# Altium schematic sheet TOP.SchDoc: =ProjectName
size 420 x 297 mm; Author: Paweł Kulik; CompanyName: WUT; DrawnBy: Paweł Kulik; Organization: WUT ISE; Address1: Warsaw Univeristy of Technology; Address2: Nowowiejska 15/19; DocumentNumber: 1; Revision: 2.0.2; SheetNumber: 1; SheetTotal: 11; EDA_Number: ARTIQ; Projet: ARTIQ/SINARA; ModifiedBy: -; CheckedDate: -; Title2: TOP.SchDoc; DivGrp: ISE; Designer: Paweł Kulik; ModifiedDate: -; ProjectName: ARTIQ/SINARA
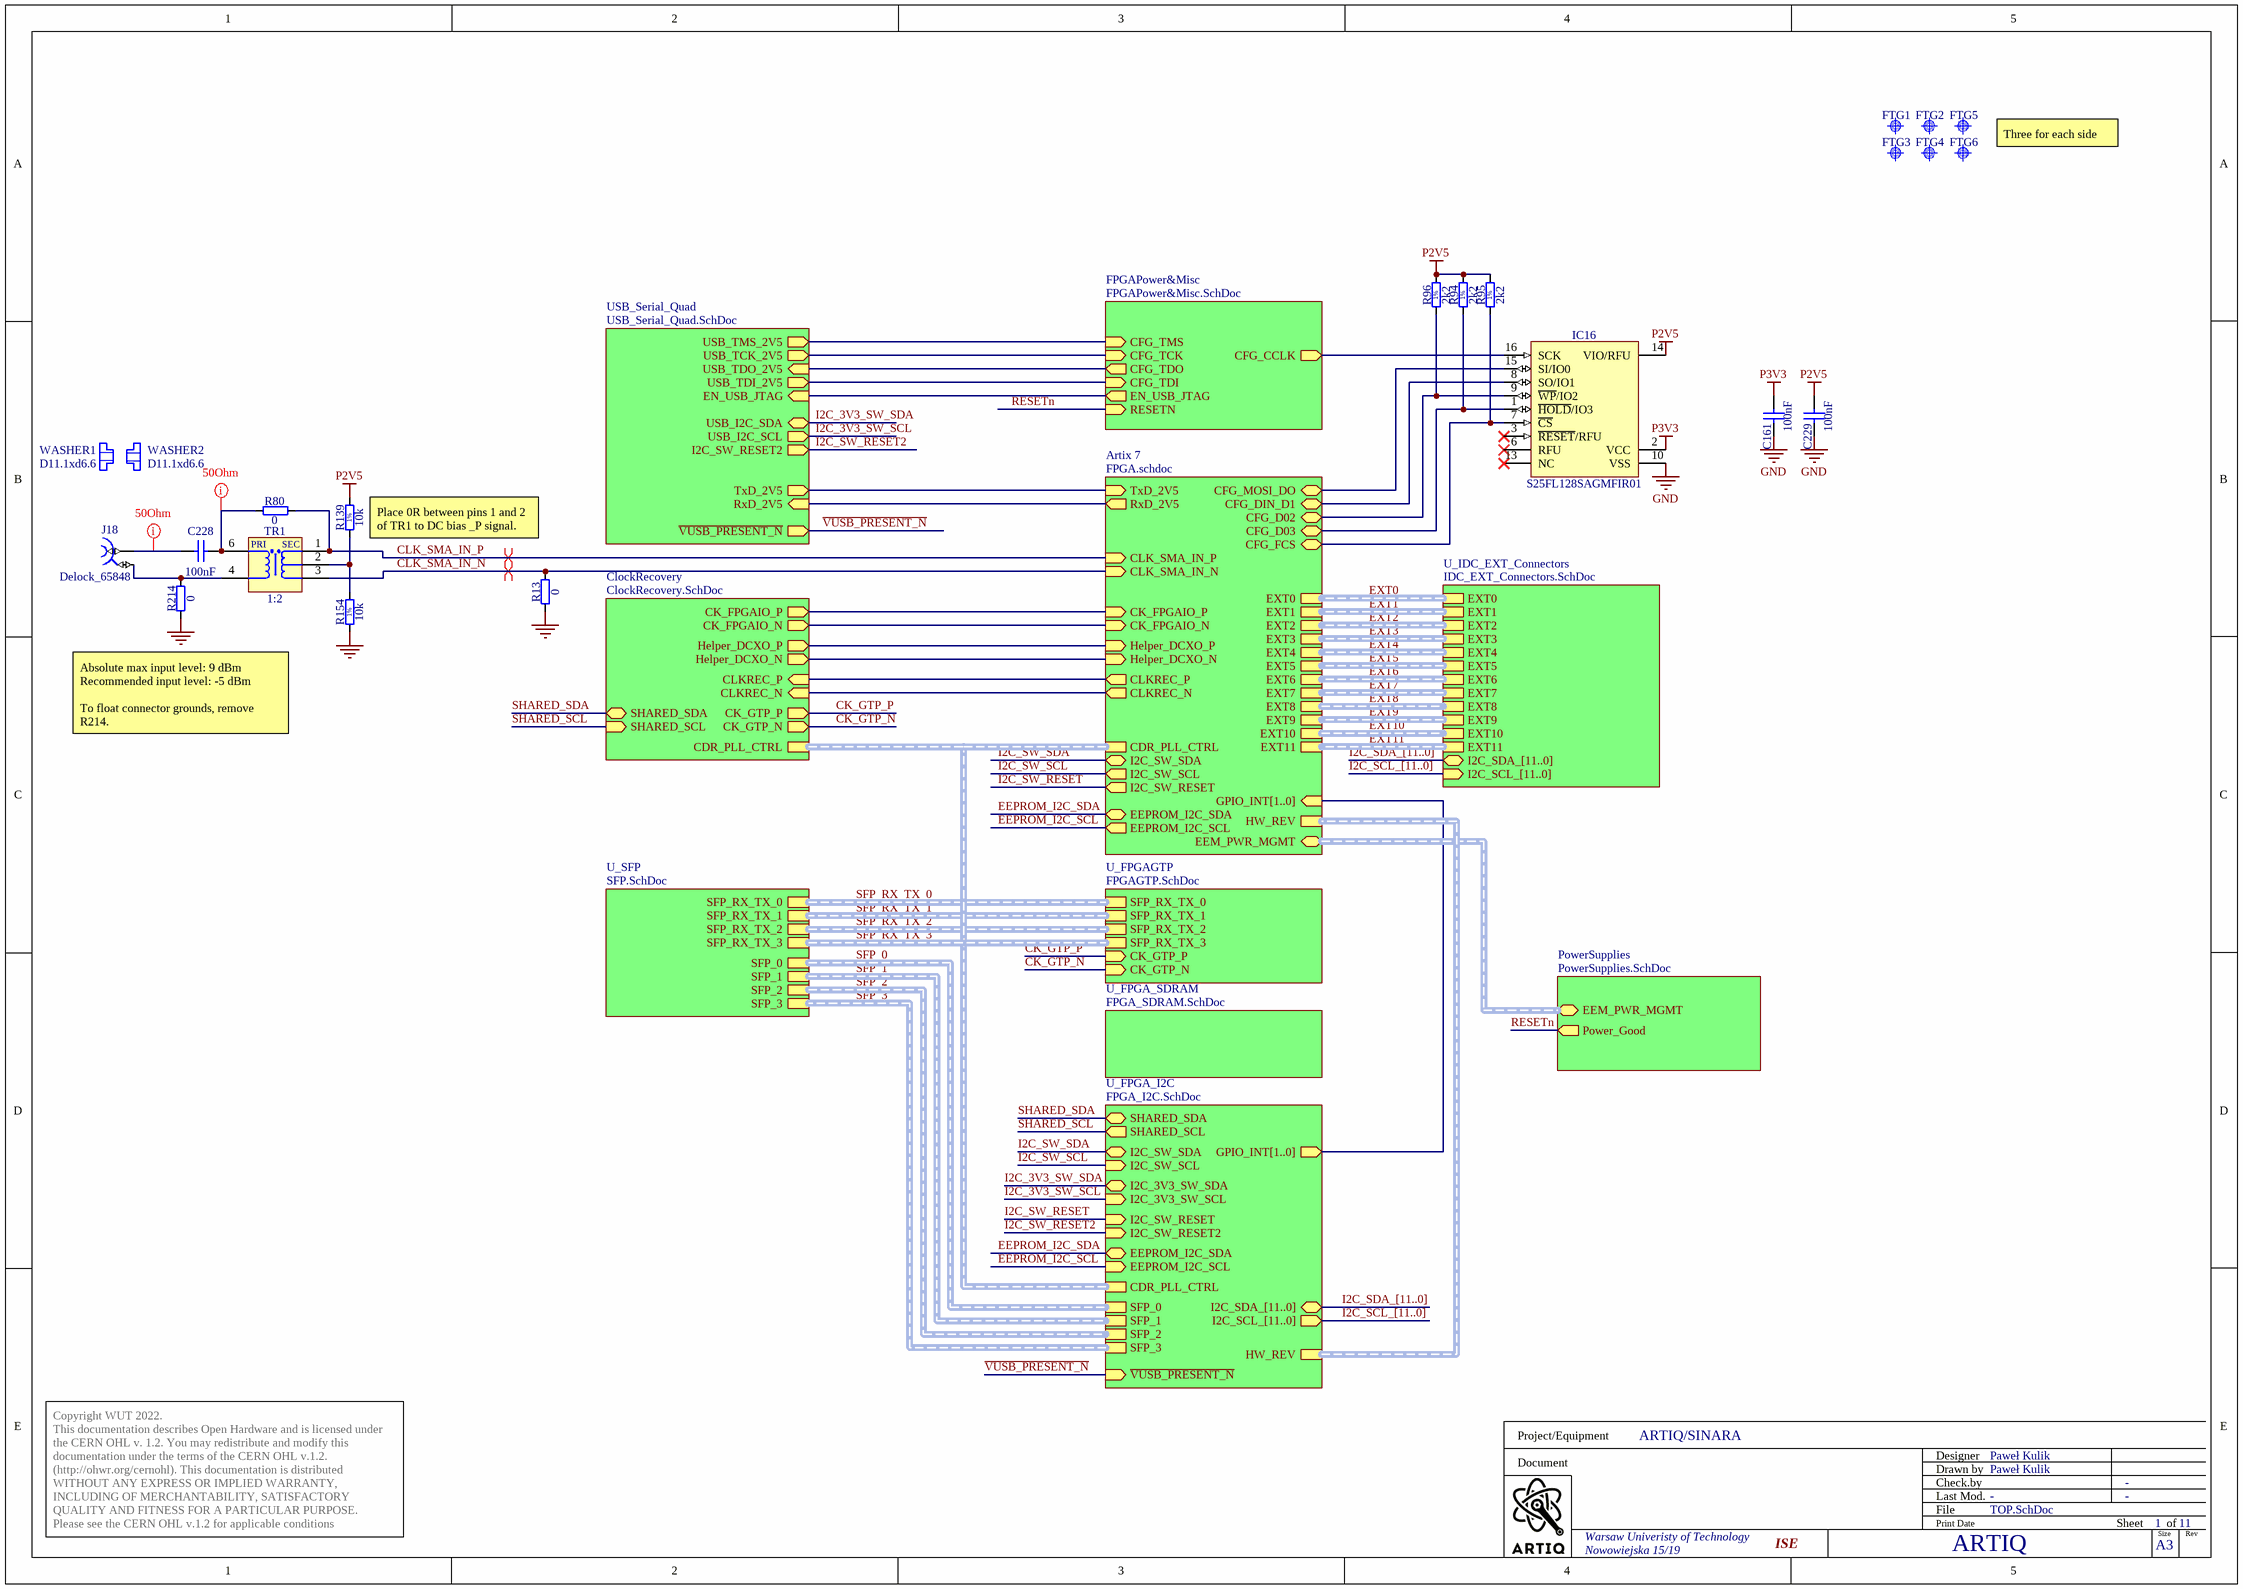
[diagram p0: TOP.SchDoc]

## Parts
C161  100nF  [CAPC0603X33N]
C228  100nF  [CAPC0603X33N]
C229  100nF  [CAPC0603X33N]
FTG1  Use only in PCB  [FIDUCIAL_TOP_C100-200]  (value not drawn)  (no BOM)
FTG2  Use only in PCB  [FIDUCIAL_TOP_S100-200]  (value not drawn)  (no BOM)
FTG3  Use only in PCB  [FIDUCIAL_TOP_C100-200]  (value not drawn)  (no BOM)
FTG4  Use only in PCB  [FIDUCIAL_TOP_C100-200]  (value not drawn)  (no BOM)
FTG5  Use only in PCB  [FIDUCIAL_TOP_C100-200]  (value not drawn)  (no BOM)
FTG6  Use only in PCB  [FIDUCIAL_TOP_S100-200]  (value not drawn)  (no BOM)
IC16  S25FL128SAGMFIR01  [SOIC127P1030X265-16N]
J18  Delock_65848  [Delock_65848]
R13  0  [RESC1005X40N]
R80  0  [RESC1005X40N]
R94  2k2  [RESC1005X40N]
R95  2k2  [RESC1005X40N]
R96  2k2  [RESC1005X40N]
R139  10k  [RESC1005X40N]
R154  10k  [RESC1005X40N]
R214  0  [RESC1005X40N]
TR1  1:2  [XFMR_MINI-CIRCUITS_AT1521]
WASHER1  D11.1xd6.6  [Keystone_7687]
WASHER2  D11.1xd6.6  [Keystone_7687]

## Sub-sheets
Artix 7 = FPGA.schdoc: CLKREC_P (out), CLKREC_N (out), CK_FPGAIO_P (in), CK_FPGAIO_N (in), I2C_SW_SDA (bidir), I2C_SW_SCL (out), CFG_MOSI_DO (bidir), CFG_DIN_D1 (bidir), CFG_D02 (bidir), CFG_D03 (bidir), CFG_FCS (bidir), TxD_2V5 (in), RxD_2V5 (out), GPIO_INT[1..0] (in), CDR_PLL_CTRL (harness CDR_PLL_CTRL), CLK_SMA_IN_P (in), Helper_DCXO_N (in), Helper_DCXO_P (in), I2C_SW_RESET (out), CLK_SMA_IN_N (in), EXT9 (harness ExtensionConnector), EXT7 (harness ExtensionConnector), EXT6 (harness ExtensionConnector), EXT11 (harness ExtensionConnector), EXT8 (harness ExtensionConnector), EXT10 (harness ExtensionConnector), EXT5 (harness ExtensionConnector), EXT4 (harness ExtensionConnector), EXT3 (harness ExtensionConnector), EXT2 (harness ExtensionConnector), EXT1 (harness ExtensionConnector), EXT0 (harness ExtensionConnector), EEPROM_I2C_SCL (out), EEPROM_I2C_SDA (bidir), EEM_PWR_MGMT (bidir), HW_REV
ClockRecovery = ClockRecovery.SchDoc: CLKREC_P (in), CLKREC_N (in), SHARED_SDA (bidir), SHARED_SCL (in), CK_GTP_P (out), CK_GTP_N (out), CK_FPGAIO_P (out), CK_FPGAIO_N (out), CDR_PLL_CTRL (harness CDR_PLL_CTRL), Helper_DCXO_N (out), Helper_DCXO_P (out)
FPGAPower&Misc = FPGAPower&Misc.SchDoc: RESETN (in), CFG_CCLK (out), CFG_TMS (in), CFG_TCK (in), CFG_TDO (out), CFG_TDI (in), EN_USB_JTAG (out)
PowerSupplies = PowerSupplies.SchDoc: Power_Good (out), EEM_PWR_MGMT (bidir)
U_FPGA_I2C = FPGA_I2C.SchDoc: I2C_SDA_[11..0] (bidir), I2C_SW_SDA (bidir), I2C_SCL_[11..0] (out), SHARED_SDA (bidir), SHARED_SCL (out), I2C_SW_SCL (in), I2C_3V3_SW_SCL (in), I2C_3V3_SW_SDA (bidir), I2C_SW_RESET (in), SFP_0 (harness SFP), SFP_2 (harness SFP), SFP_1 (harness SFP), ~{VUSB_PRESENT_N} (in), GPIO_INT[1..0] (out), CDR_PLL_CTRL (harness CDR_PLL_CTRL), SFP_3 (harness SFP), I2C_SW_RESET2 (in), EEPROM_I2C_SDA (bidir), EEPROM_I2C_SCL (in), HW_REV (harness HW_REV)
U_FPGA_SDRAM = FPGA_SDRAM.SchDoc: no entries
U_FPGAGTP = FPGAGTP.SchDoc: SFP_RX_TX_0 (harness SFP_RX_TX), SFP_RX_TX_1 (harness SFP_RX_TX), SFP_RX_TX_2 (harness SFP_RX_TX), CK_GTP_P (in), CK_GTP_N (in), SFP_RX_TX_3 (harness SFP_RX_TX)
U_IDC_EXT_Connectors = IDC_EXT_Connectors.SchDoc: I2C_SDA_[11..0] (bidir), I2C_SCL_[11..0] (in), EXT7 (harness ExtensionConnector), EXT9 (harness ExtensionConnector), EXT11 (harness ExtensionConnector), EXT6 (harness ExtensionConnector), EXT2 (harness ExtensionConnector), EXT10 (harness ExtensionConnector), EXT8 (harness ExtensionConnector), EXT5 (harness ExtensionConnector), EXT3 (harness ExtensionConnector), EXT4 (harness ExtensionConnector), EXT0 (harness ExtensionConnector), EXT1 (harness ExtensionConnector)
U_SFP = SFP.SchDoc: SFP_0 (harness SFP), SFP_RX_TX_0 (harness SFP_RX_TX), SFP_2 (harness SFP), SFP_RX_TX_1 (harness SFP_RX_TX), SFP_RX_TX_2 (harness SFP_RX_TX), SFP_1 (harness SFP), SFP_3 (harness SFP), SFP_RX_TX_3 (harness SFP_RX_TX)
USB_Serial_Quad = USB_Serial_Quad.SchDoc: USB_TDO_2V5 (in), RxD_2V5 (in), USB_TMS_2V5 (out), USB_TDI_2V5 (out), USB_TCK_2V5 (out), TxD_2V5 (out), EN_USB_JTAG (in), USB_I2C_SCL (out), USB_I2C_SDA (bidir), ~{VUSB_PRESENT_N} (out), I2C_SW_RESET2 (out)

## Nets
GND: C161.1 C229.1 IC16.10(VSS) R13.1 R154.2 R214.1
P2V5: C229.2 IC16.14(VIO/RFU) R94.2 R95.2 R96.2 R139.1
P3V3: C161.2 IC16.2(VCC)
~{VUSB_PRESENT_N}: sheet U_FPGA_I2C/~{VUSB_PRESENT_N}, sheet USB_Serial_Quad/~{VUSB_PRESENT_N}
CK_GTP_N: sheet ClockRecovery/CK_GTP_N, sheet U_FPGAGTP/CK_GTP_N
CK_GTP_P: sheet ClockRecovery/CK_GTP_P, sheet U_FPGAGTP/CK_GTP_P
CLK_SMA_IN_N: R13.2 TR1.3(S) ; sheet Artix 7/CLK_SMA_IN_N
CLK_SMA_IN_P: R80.2 TR1.1(SDOT) ; sheet Artix 7/CLK_SMA_IN_P
EEPROM_I2C_SCL: sheet Artix 7/EEPROM_I2C_SCL, sheet U_FPGA_I2C/EEPROM_I2C_SCL
EEPROM_I2C_SDA: sheet Artix 7/EEPROM_I2C_SDA, sheet U_FPGA_I2C/EEPROM_I2C_SDA
I2C_3V3_SW_SCL: sheet U_FPGA_I2C/I2C_3V3_SW_SCL, sheet USB_Serial_Quad/USB_I2C_SCL
I2C_3V3_SW_SDA: sheet U_FPGA_I2C/I2C_3V3_SW_SDA, sheet USB_Serial_Quad/USB_I2C_SDA
I2C_SW_RESET: sheet Artix 7/I2C_SW_RESET, sheet U_FPGA_I2C/I2C_SW_RESET
I2C_SW_RESET2: sheet U_FPGA_I2C/I2C_SW_RESET2, sheet USB_Serial_Quad/I2C_SW_RESET2
I2C_SW_SCL: sheet Artix 7/I2C_SW_SCL, sheet U_FPGA_I2C/I2C_SW_SCL
I2C_SW_SDA: sheet Artix 7/I2C_SW_SDA, sheet U_FPGA_I2C/I2C_SW_SDA
RESETn: sheet PowerSupplies/Power_Good, sheet FPGAPower&Misc/RESETN
SHARED_SCL: sheet ClockRecovery/SHARED_SCL, sheet U_FPGA_I2C/SHARED_SCL
SHARED_SDA: sheet ClockRecovery/SHARED_SDA, sheet U_FPGA_I2C/SHARED_SDA
NetC228_1: C228.1 J18.1
NetC228_2: C228.2 R80.1 TR1.6(PDOT)
NetIC16_1: IC16.1(~{HOLD}/IO3) R94.1 ; sheet Artix 7/CFG_D03
NetIC16_7: IC16.7(~{CS}) R95.1 ; sheet Artix 7/CFG_FCS
NetIC16_8: IC16.8(SO/IO1) ; sheet Artix 7/CFG_DIN_D1
NetIC16_9: IC16.9(~{WP}/IO2) R96.1 ; sheet Artix 7/CFG_D02
NetIC16_15: IC16.15(SI/IO0) ; sheet Artix 7/CFG_MOSI_DO
NetIC16_16: IC16.16(SCK) ; sheet FPGAPower&Misc/CFG_CCLK
NetJ18_2: J18.2 R214.2 TR1.4(P)
NetR139_2: R139.2 R154.1 TR1.2(NC)
(unnamed): sheet Artix 7/CLKREC_P, sheet ClockRecovery/CLKREC_P
(unnamed): sheet Artix 7/CLKREC_N, sheet ClockRecovery/CLKREC_N
(unnamed): sheet Artix 7/CK_FPGAIO_P, sheet ClockRecovery/CK_FPGAIO_P
(unnamed): sheet Artix 7/CK_FPGAIO_N, sheet ClockRecovery/CK_FPGAIO_N
(unnamed): sheet Artix 7/TxD_2V5, sheet USB_Serial_Quad/TxD_2V5
(unnamed): sheet Artix 7/RxD_2V5, sheet USB_Serial_Quad/RxD_2V5
(unnamed): sheet Artix 7/Helper_DCXO_N, sheet ClockRecovery/Helper_DCXO_N
(unnamed): sheet Artix 7/Helper_DCXO_P, sheet ClockRecovery/Helper_DCXO_P
(unnamed): sheet FPGAPower&Misc/CFG_TMS, sheet USB_Serial_Quad/USB_TMS_2V5
(unnamed): sheet FPGAPower&Misc/CFG_TCK, sheet USB_Serial_Quad/USB_TCK_2V5
(unnamed): sheet FPGAPower&Misc/CFG_TDO, sheet USB_Serial_Quad/USB_TDO_2V5
(unnamed): sheet FPGAPower&Misc/CFG_TDI, sheet USB_Serial_Quad/USB_TDI_2V5
(unnamed): sheet FPGAPower&Misc/EN_USB_JTAG, sheet USB_Serial_Quad/EN_USB_JTAG

Not connected (* = marked no-connect by the designer): IC16 3(~{RESET}/RFU)* 6(RFU)* 13(NC)*

## Buses and harness runs
bus I2C_SCL_[11..0] = sheet U_FPGA_I2C/I2C_SCL_[11..0]
bus I2C_SCL_[11..0] = sheet U_IDC_EXT_Connectors/I2C_SCL_[11..0]
bus I2C_SDA_[11..0] = sheet U_FPGA_I2C/I2C_SDA_[11..0]
bus I2C_SDA_[11..0] = sheet U_IDC_EXT_Connectors/I2C_SDA_[11..0]
bus sheet Artix 7/GPIO_INT[1..0] = sheet U_FPGA_I2C/GPIO_INT[1..0]
harness EXT0 = sheet Artix 7/EXT0 = sheet U_IDC_EXT_Connectors/EXT0
harness EXT1 = sheet Artix 7/EXT1 = sheet U_IDC_EXT_Connectors/EXT1
harness EXT2 = sheet Artix 7/EXT2 = sheet U_IDC_EXT_Connectors/EXT2
harness EXT3 = sheet Artix 7/EXT3 = sheet U_IDC_EXT_Connectors/EXT3
harness EXT4 = sheet Artix 7/EXT4 = sheet U_IDC_EXT_Connectors/EXT4
harness EXT5 = sheet Artix 7/EXT5 = sheet U_IDC_EXT_Connectors/EXT5
harness EXT6 = sheet Artix 7/EXT6 = sheet U_IDC_EXT_Connectors/EXT6
harness EXT7 = sheet Artix 7/EXT7 = sheet U_IDC_EXT_Connectors/EXT7
harness EXT8 = sheet Artix 7/EXT8 = sheet U_IDC_EXT_Connectors/EXT8
harness EXT9 = sheet Artix 7/EXT9 = sheet U_IDC_EXT_Connectors/EXT9
harness EXT10 = sheet Artix 7/EXT10 = sheet U_IDC_EXT_Connectors/EXT10
harness EXT11 = sheet Artix 7/EXT11 = sheet U_IDC_EXT_Connectors/EXT11
harness SFP_0 = sheet U_FPGA_I2C/SFP_0 = sheet U_SFP/SFP_0
harness SFP_1 = sheet U_FPGA_I2C/SFP_1 = sheet U_SFP/SFP_1
harness SFP_2 = sheet U_FPGA_I2C/SFP_2 = sheet U_SFP/SFP_2
harness SFP_3 = sheet U_FPGA_I2C/SFP_3 = sheet U_SFP/SFP_3
harness SFP_RX_TX_0 = sheet U_FPGAGTP/SFP_RX_TX_0 = sheet U_SFP/SFP_RX_TX_0
harness SFP_RX_TX_1 = sheet U_FPGAGTP/SFP_RX_TX_1 = sheet U_SFP/SFP_RX_TX_1
harness SFP_RX_TX_2 = sheet U_FPGAGTP/SFP_RX_TX_2 = sheet U_SFP/SFP_RX_TX_2
harness SFP_RX_TX_3 = sheet U_FPGAGTP/SFP_RX_TX_3 = sheet U_SFP/SFP_RX_TX_3
harness sheet Artix 7/CDR_PLL_CTRL = sheet ClockRecovery/CDR_PLL_CTRL = sheet U_FPGA_I2C/CDR_PLL_CTRL
harness sheet Artix 7/EEM_PWR_MGMT = sheet PowerSupplies/EEM_PWR_MGMT
harness sheet Artix 7/HW_REV = sheet U_FPGA_I2C/HW_REV

## Layout directives
net class 50Ohm: NetC228_1, NetC228_2
differential pair; differential pair class Diff_100Ohm: CLK_SMA_IN_N, CLK_SMA_IN_P

## Notes on the sheet
- Three for each side
- (near R139) Place 0R between pins 1 and 2 of TR1 to DC bias _P signal.
- (near R214) Absolute max input level: 9 dBm
  Recommended input level: -5 dBm
  To float connector grounds, remove R214.
- Project/Equipment
- Document
- Designer
- Drawn by
- Check.by
- Copyright WUT 2022.
  This documentation describes Open Hardware and is licensed under the CERN OHL v. 1.2. You may redistribute and modify this documentation under the terms of the CERN OHL v.1.2. (http://ohwr.org/cernohl). This documentation is distributed WITHOUT ANY EXPRESS OR IMPLIED WARRANTY, INCLUDING OF MERCHANTABILITY, SATISFACTORY QUALITY AND FITNESS FOR A PARTICULAR PURPOSE. Please see the CERN OHL v.1.2 for applicable conditions
- File
- Last Mod.
- Print Date
- Sheet
- Size
- A3
- of
- Rev
- (in symbol R0402_2K2_1%_0.0625W_100PPM) 1%
- (in symbol R0402_10K_1%_0.0625W_100PPM) 1%
- (in symbol XFMR_MINI-CIRCUITS_TC2-1TX+) PRI; SEC

## Library data of the parts
C161 C228 C229 = CC0201_100NF_6.3V_10%_X5R: Non-polarised capacitor; Part Description: SMD Multilayer Chip Ceramic Capacitor; Manufacturer: GENERIC; Manufacturer1 Part Number: 02016D104KAT2A; Voltage: 6.3V; TC: X5R; Tolerance: ±10%; Part Number: CC0201_100NF_6.3V_10%_X5R; Component Kind: Standard; Component Type: Standard; Pin Count: 2; Value: 100nF; Status: Not Recommended; Manufacturer Part Number: CC0201_100NF_6.3V_10%_X5R; Case: 0201; Mounted: Yes; Socket: No; SMD: Yes; Sense: No; Manufacturer1 Example: AVX; Manufacturer1 ComponentHeight: 0.33mm; HelpURL: \\cern.ch\dfs\Applications\Altium\Datasheets\CC0201_X5R_AVX.pdf; Author: CERN DEM JLC
  C161 C229: CreateDate: 03.12.2007; LatestRevisionDate: 03.12.2007; ClassName: Artix
  C228: CreateDate: 2007-12-03; LatestRevisionDate: 2007-12-03
FTG1 FTG3-FTG5 = FIDUCIAL_TARGET_C100-200: Fiducial Target; Part Description: Round Fiducial Target, Top Layer, 1.0mm, Top Solder 2.0mm, Keepout =2.0mm; Mounted: No; Part Number: FIDUCIAL_TARGET_C100-200; Component Type: Standard (No BOM); Pin Count: 1; Family: Fiducial; Socket: No; SMD: Yes; Sense: No; Status: None; ComponentHeight: 0mm; HelpURL: Undefined; Author: CERN DEM JLC; CreateDate: 09.02.2010; LatestRevisionDate: 04.04.2012; PackageDescription: Round Fiducial Target, Top Layer, 1.0mm, Top Solder 2.0mm, Keepout =2.0mm
FTG2 FTG6 = FIDUCIAL_TARGET_S100-200: Fiducial Target; Part Description: Square Fiducial Target, Top Layer, 1.0mm, Top Solder 2.0mm, Keepout =2.0mm; Mounted: No; Part Number: FIDUCIAL_TARGET_S100-200; Component Type: Standard (No BOM); Pin Count: 1; Family: Fiducial; Socket: No; SMD: Yes; Sense: No; Status: None; ComponentHeight: 0mm; HelpURL: Undefined; Author: CERN DEM JLC; CreateDate: 09.02.2010; LatestRevisionDate: 04.04.2012; PackageDescription: Square Fiducial Target, Top Layer, 1.0mm, Top Solder 2.0mm, Keepout =2.0mm
IC16 = S25FL128SAGMFIR01: 128Mbit, MirrorBit® Flash Non-Volatile Memory CMOS 3.0 Volt Core with Versatile I/O Serial Peripheral Interface with Multi-I/O; Part Description: 128Mbit, 133MHz, MirrorBit® Flash Non-Volatile Memory CMOS 3V Core with Versatile I/O Serial Peripheral Interface with Multi-I/O; Manufacturer: SPANSION; PressFit: No; Bonding: No; Part Number: S25FL128SAGMFIR01; Component Kind: Standard; Component Type: Standard; Device: S25FL128SAGMFIR01; PackageDescription: SOIC 16, Pitch 1.27mm - Body 7.5x10.3mm, IPC Medium Density; Manufacturer Part Number: S25FL128SAGMFIR01; Pin Count: 11; Case: SOIC16; Mounted: Yes; Socket: No; SMD: Yes; Sense: No; ComponentHeight: 2.65mm; HelpURL: \\cern.ch\dfs\Applications\Altium\Datasheets\S25FL128SAGMFIR01.pdf; Author: CERN DEM JLC; CreateDate: 2014-07-10; LatestRevisionDate: 2014-07-10
J18 = CMP-002-04652-1: SMA connector Delock 65848
R13 R80 R214 = R0402_0R_JUMPER: Resistor; Part Description: 1A (0.05R Max DC Resistance) Zero Ohm Jumper; Manufacturer: GENERIC; Manufacturer1 Part Number: 232270591001L; PressFit: No; Part Number: R0402_0R_JUMPER; Component Kind: Standard; Component Type: Standard; Pin Count: 2; Value: 0; Status: Not Recommended; Manufacturer Part Number: R0402_0R_JUMPER; Case: 0402; Mounted: Yes; Sense: No; Socket: No; SMD: Yes; Manufacturer1 Example: YAGEO PHYCOMP; Manufacturer1 ComponentHeight: 0.4mm; HelpURL: \\cern.ch\dfs\Applications\Altium\Datasheets\R0402_Phycomp_RC0402.pdf; Author: CERN DEM JLC; CreateDate: 03.12.2007; LatestRevisionDate: 17.10.2012
R94-R96 = R0402_2K2_1%_0.0625W_100PPM: Resistor - 1%; Part Description: General Purpose Thick Film Chip Resistor; Manufacturer: GENERIC; Manufacturer1 Part Number: 232270672202L; TC: ±100ppm/°C; PressFit: No; Part Number: R0402_2K2_1%_0.0625W_100PPM; Component Kind: Standard; Component Type: Standard; Pin Count: 2; Value: 2k2; Status: Not Recommended; Power: 0.0625W; Tolerance: ±1%; Manufacturer Part Number: R0402_2K2_1%_0.0625W_100PPM; Case: 0402; Mounted: Yes; Sense: No; Socket: No; SMD: Yes; Manufacturer1 Example: YAGEO PHYCOMP; Manufacturer1 ComponentHeight: 0.4mm; HelpURL: \\cern.ch\dfs\Applications\Altium\Datasheets\R0402_Phycomp_RC0402.pdf; Author: CERN DEM JLC; CreateDate: 03.12.2007; LatestRevisionDate: 17.10.2012; ClassName: Artix
R139 R154 = R0402_10K_1%_0.0625W_100PPM: Resistor - 1%; Part Description: General Purpose Thick Film Chip Resistor; Manufacturer: GENERIC; Manufacturer1 Part Number: 232270671003L; TC: ±100ppm/°C; PressFit: No; Part Number: R0402_10K_1%_0.0625W_100PPM; Component Kind: Standard; Component Type: Standard; Pin Count: 2; Value: 10k; Status: Not Recommended; Power: 0.0625W; Tolerance: ±1%; Manufacturer Part Number: R0402_10K_1%_0.0625W_100PPM; Case: 0402; Mounted: Yes; Sense: No; Socket: No; SMD: Yes; Manufacturer1 Example: YAGEO PHYCOMP; Manufacturer1 ComponentHeight: 0.4mm; HelpURL: \\cern.ch\dfs\Applications\Altium\Datasheets\R0402_Phycomp_RC0402.pdf; Author: CERN DEM JLC; CreateDate: 03.12.2007; LatestRevisionDate: 17.10.2012
TR1 = XFMR_MINI-CIRCUITS_TC2-1TX+: 50 Ohms 3 to 300MHz RF Transformer; Part Number: XFMR_MINI-CIRCUITS_TC2-1TX+; Component Kind: Standard; Component Type: Standard; Pin Count: 5; Value: 1:2; Status: None; Part Description: 50 Ohms 3 to 300MHz RF Transformer; Manufacturer: MINI-CIRCUITS; Manufacturer Part Number: TC2-1TX+; Mounted: Yes; Socket: No; Sense: No; SMD: Yes; ComponentHeight: 4.06mm; HelpURL: \\cern.ch\dfs\Applications\Altium\Datasheets\XFMR_MINI-CIRCUITS_TC2-1TX+.pdf; Author: CERN DEM MR; CreateDate: 18.10.2019; LatestRevisionDate: 18.10.2019
WASHER1 WASHER2 = Keystone_7687: SMA_Shoulder Washer; Part Description: Polyphenylene Sulfide PPS Shoulder Washer; Manufacturer Part Number: 7687; PressFit: No; Part Number: Keystone 7687; Component Kind: Standard; Component Type: Mechanical; Pin Count: 0; PackageDescription: Polyphenylene Sulfide PPS Shoulder Washer; Mounted: Yes; Socket: No; SMD: No; Sense: No; Status: None; Value: D11.1xd6.6; Manufacturer: Keystone; ComponentHeight: 1.91mm; HelpURL: \\cern.ch\dfs\Applications\Altium\Datasheets\AAVID-THERMALLOY_7721-7PPSG.pdf; Author: GK; CreateDate: 28.01.2016; LatestRevisionDate: 28.01.2016